# EAGLE design glitch_delay (EAGLE 8.6.0)
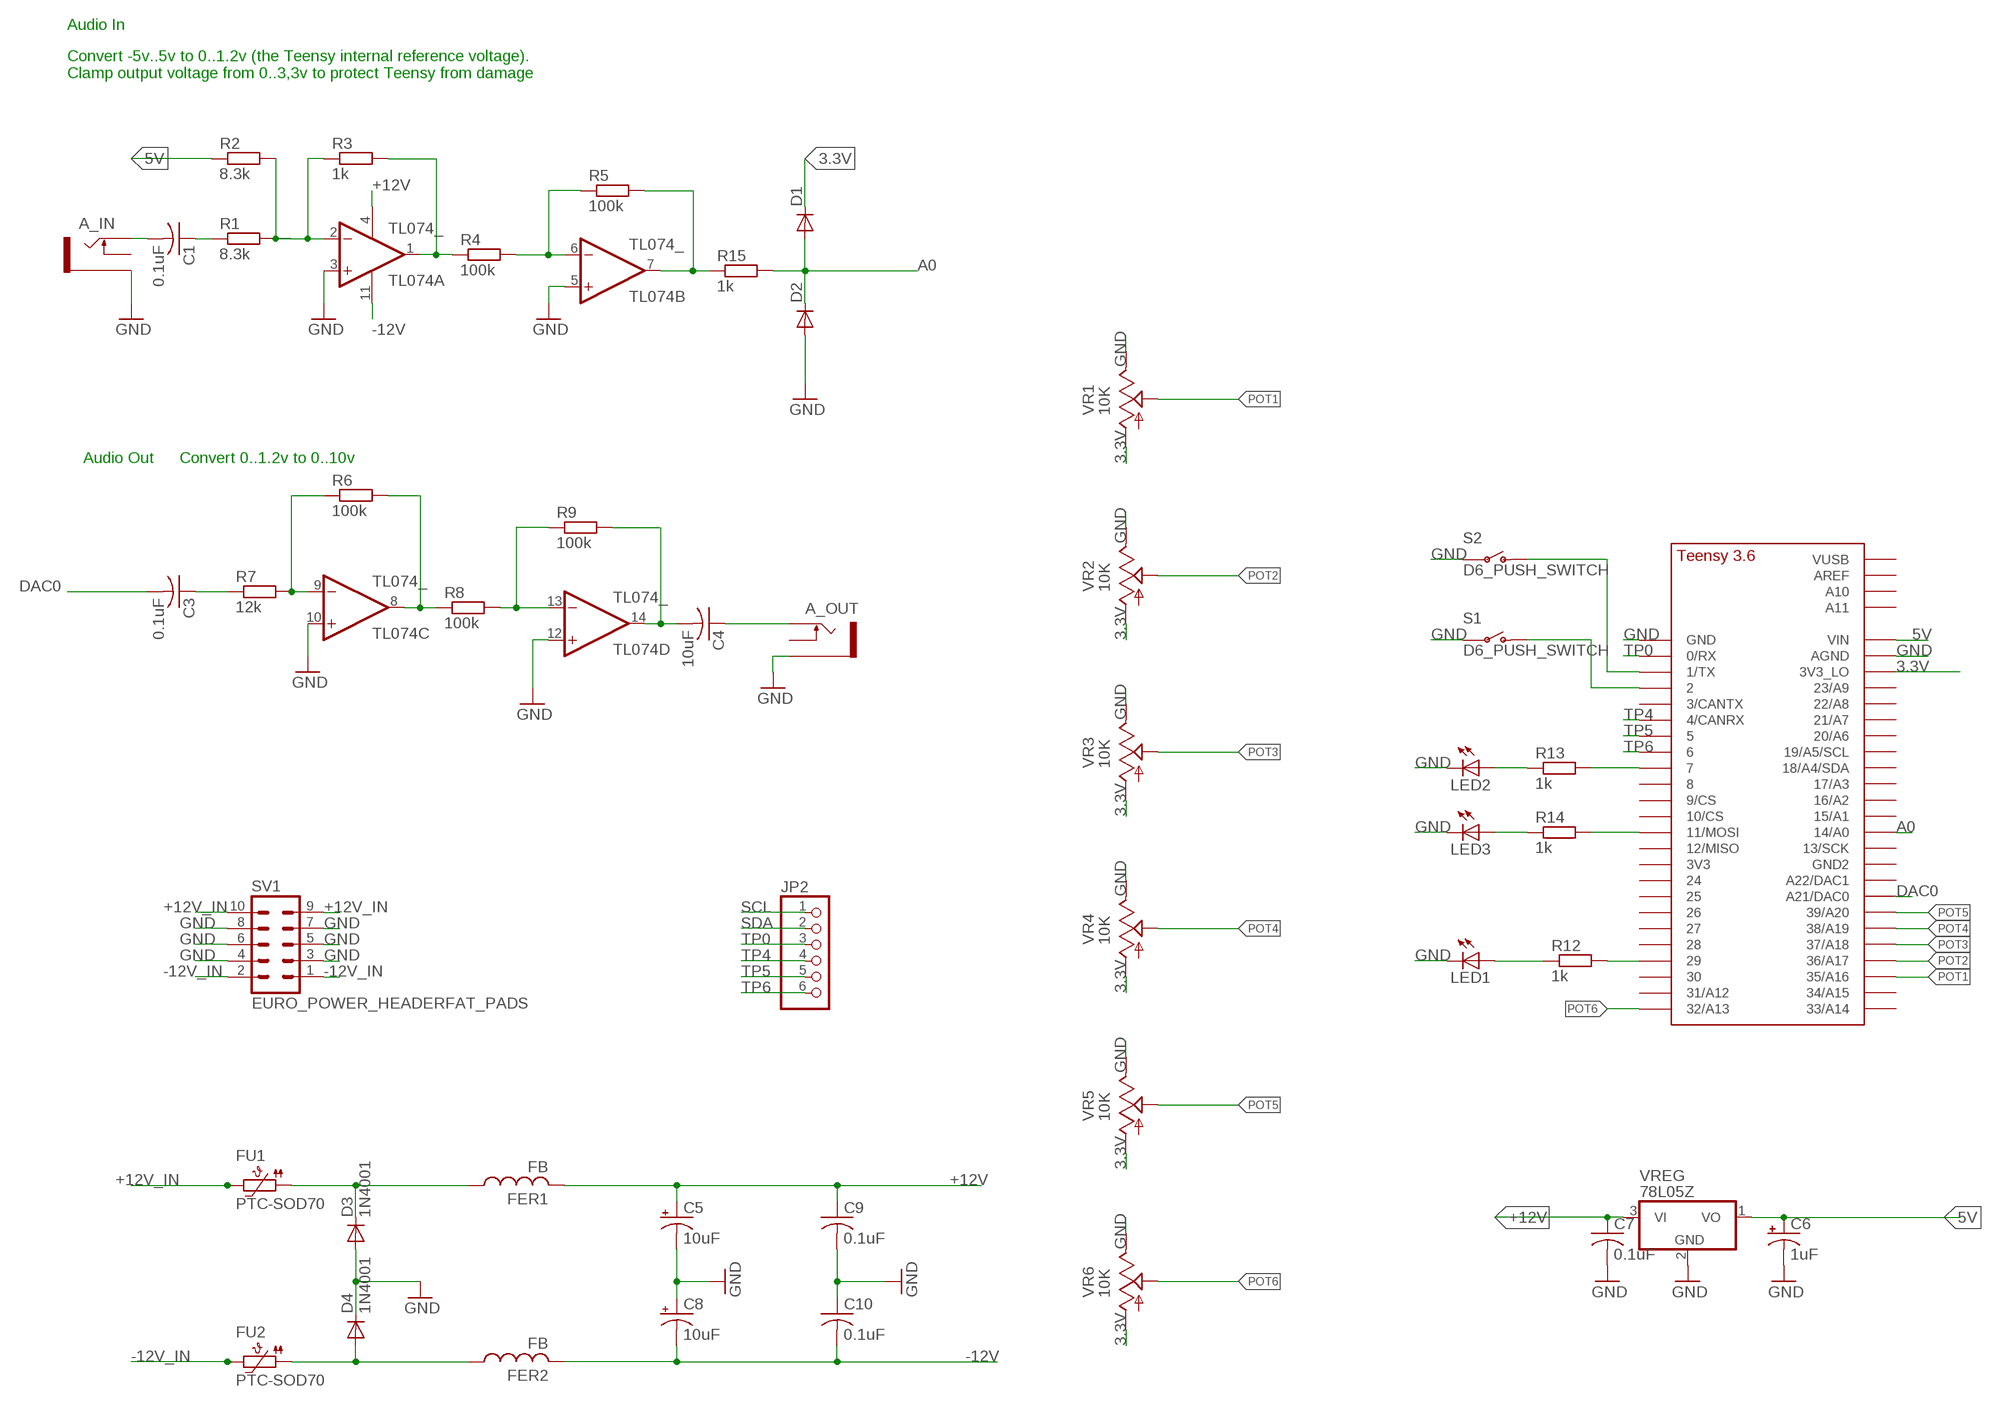
[diagram p0: schematic, sheet 1]

## Parts
A_IN  THONKICONNNEW  [WQP-PJ301M-12_JACK]
A_OUT  THONKICONNNEW  [WQP-PJ301M-12_JACK]
C1  0.1uF  C-US025-030X050  [C025-030X050]
C3  0.1uF  C-US025-030X050  [C025-030X050]
C4  10uF  C-US025-030X050  [C025-030X050]
C5  10uF  CPOL-USE2,5-6E  [E2,5-6E]
C6  1uF  CPOL-USE2.5-7  [E2,5-7]
C7  0.1uF  C-US025-030X050  [C025-030X050]
C8  10uF  CPOL-USE2,5-6E  [E2,5-6E]
C9  0.1uF  C-US025-030X050  [C025-030X050]
C10  0.1uF  C-US025-030X050  [C025-030X050]
D1  SMALL_DIODEDO35-7  [DO35-7]
D2  SMALL_DIODEDO35-7  [DO35-7]
D3  1N4001  1N4004  [DO41-10]
D4  1N4001  1N4004  [DO41-10]
FER1  FB  [FB]
FER2  FB  [FB]
FU1  PTC-SOD70  [SOD70]
FU2  PTC-SOD70  [SOD70]
JP2  PINHD-1X6  [1X06]
LED1  LED3MM  [LED3MM]
LED2  LED3MM  [LED3MM]
LED3  LED3MM  [LED3MM]
R1  8.3k  RESISTOR7MM  [7MM_RESISTOR]
R2  8.3k  RESISTOR7MM  [7MM_RESISTOR]
R3  1k  RESISTOR7MM  [7MM_RESISTOR]
R4  100k  RESISTOR7MM  [7MM_RESISTOR]
R5  100k  RESISTOR7MM  [7MM_RESISTOR]
R6  100k  RESISTOR7MM  [7MM_RESISTOR]
R7  12k  RESISTOR7MM  [7MM_RESISTOR]
R8  100k  RESISTOR7MM  [7MM_RESISTOR]
R9  100k  RESISTOR7MM  [7MM_RESISTOR]
R12  1k  RESISTOR7MM  [7MM_RESISTOR]
R13  1k  RESISTOR7MM  [7MM_RESISTOR]
R14  1k  RESISTOR7MM  [7MM_RESISTOR]
R15  1k  RESISTOR7MM  [7MM_RESISTOR]
S1  D6_PUSH_SWITCH  [D6_PUSH_SWITCH]
S2  D6_PUSH_SWITCH  [D6_PUSH_SWITCH]
SV1  EURO_POWER_HEADERFAT_PADS  [EURO_PWR_HEADER_FAT]
TL074  TL074_  [DIL14]
U$1  TEENSY_3.5/3.6_BASIC  [TEENSY_3.5/3.6_BASIC]
VR1  10K  9MM_SNAP-IN_POT_  [9MM_SNAP-IN_POT]
VR2  10K  9MM_SNAP-IN_POT_  [9MM_SNAP-IN_POT]
VR3  10K  9MM_SNAP-IN_POT_  [9MM_SNAP-IN_POT]
VR4  10K  9MM_SNAP-IN_POT_  [9MM_SNAP-IN_POT]
VR5  10K  9MM_SNAP-IN_POT_  [9MM_SNAP-IN_POT]
VR6  10K  9MM_SNAP-IN_POT_  [9MM_SNAP-IN_POT]
VREG  78L05Z  [TO92]

## Nets
3.3V: D1.C U$1.3V3_LO VR1.1(A) VR2.1(A) VR3.1(A) VR4.1(A) VR5.1(A) VR6.1(A)
5V: C6.+ R2.1 U$1.VIN VREG.1(VO)
+12V: C5.+ C7.1 C9.1 FER1.P$2 TL074.4(P:V+) VREG.3(VI)
+12V_IN: FU1.2 SV1.9 SV1.10
-12V: C8.- C10.2 FER2.P$2 TL074.11(P:V-)
-12V_IN: FU2.2 SV1.1 SV1.2
A0: D1.A D2.C R15.2 U$1.14/A0
DAC0: C3.2 U$1.21/DAC0(A21/DAC0)
GND: A_IN.P$3_SLEEVE(SLEEVE) A_OUT.P$3_SLEEVE(SLEEVE) C5.- C6.- C7.2 C8.+ C9.2 C10.1 D2.A D3.A D4.C LED1.K(C) LED2.K(C) LED3.K(C) S1.P$3(P) S1.P$4(P) S2.P$3(P) S2.P$4(P) SV1.3 SV1.4 SV1.5 SV1.6 SV1.7 SV1.8 TL074.3(A:+IN) TL074.5(B:+IN) TL074.10(C:+IN) TL074.12(D:+IN) U$1.AGND U$1.GND VR1.3(E) VR2.3(E) VR3.3(E) VR4.3(E) VR5.3(E) VR6.3(E) VREG.2(GND)
N$2: A_IN.P$1_TIP(TIP) C1.2
N$3: R1.2 R2.2 R3.1 TL074.2(A:-IN)
N$4: R3.2 R4.1 TL074.1(A:OUT)
N$6: R4.2 R5.1 TL074.6(B:-IN)
N$7: C1.1 R1.1
N$8: R5.2 R15.1 TL074.7(B:OUT)
N$9: LED1.A R12.1
N$13: C3.1 R7.1
N$14: R6.1 R7.2 TL074.9(C:-IN)
N$16: R6.2 R8.1 TL074.8(C:OUT)
N$17: R12.2 U$1.29
N$18: R8.2 R9.1 TL074.13(D:-IN)
N$19: LED2.A R13.1
N$20: S1.P$1(O) S1.P$2(O) U$1.2
N$21: C4.2 R9.2 TL074.14(D:OUT)
N$22: A_OUT.P$1_TIP(TIP) C4.1
N$23: LED3.A R14.1
N$25: S2.P$1(O) S2.P$2(O) U$1.1/TX
N$26: R13.2 U$1.7
N$27: R14.2 U$1.11/MOSI
N$29: D3.C FER1.P$1 FU1.1
N$30: D4.A FER2.P$1 FU2.1
POT1: U$1.35/A16 VR1.2(S)
POT2: U$1.36/A17 VR2.2(S)
POT3: U$1.37/A18 VR3.2(S)
POT4: U$1.38/A19 VR4.2(S)
POT5: U$1.39/A20 VR5.2(S)
POT6: U$1.32/A13 VR6.2(S)
SCL: JP2.1
SDA: JP2.2
TP0: JP2.3 U$1.0/RX
TP4: JP2.4 U$1.4/CANRX
TP5: JP2.5 U$1.5
TP6: JP2.6 U$1.6
Unconnected: A_IN.P$2_SWITCH(SWITCH) A_OUT.P$2_SWITCH(SWITCH) U$1.3/CANTX U$1.3V3 U$1.8 U$1.9/CS U$1.10/CS U$1.12/MISO U$1.13/SCK U$1.15/A1 U$1.16/A2 U$1.17/A3 U$1.18/A4/SDA U$1.19/A5/SCL U$1.20/A6 U$1.21/A7 U$1.22/A8 U$1.23/A9 U$1.24 U$1.25 U$1.26 U$1.27 U$1.28 U$1.30 U$1.31/A12 U$1.33/A14 U$1.34/A15 U$1.A10 U$1.A11 U$1.A22/DAC1 U$1.AREF U$1.GND2 U$1.VUSB

## Notes on the sheet
- Audio In
- Convert -5v..5v to 0..1.2v (the Teensy internal reference voltage).
  Clamp output voltage from 0..3,3v to protect Teensy from damage
- Audio Out | Convert 0..1.2v to 0..10v

## Library data of the parts
A_IN A_OUT = MusicThingModular:THONKICONN: 3.5mm socket for Eurorack modular synths
C1 C3 C4 C7 C9 C10 = adafruit:C-US: CAPACITOR, American symbol
C5 C6 C8 = adafruit:CPOL-US: POLARIZED CAPACITOR, American symbol
D1 D2 = MusicThingModular:SMALL_DIODE: Small Signal Diode
D3 D4 = adafruit:1N4004: DIODE General purpose 1N400x type rectifier (With bigger pads) http://www.ladyada.net/library/pcb/eaglelibrary.html
FER1 FER2 = adafruit:FB: Ferrite bead Digikey #P9821BK-ND
FU1 FU2 = ptc-ntc:PTC-: Positive Temperature Coefficient Resistor (PTC) termistor Philips KTY81-210 - KTY81-252 Source: 153627-da-01-en-Temperatur-Sensor_KTY10-6_Philips.pdf; OC_FARNELL: unknown; OC_NEWARK: unknown
JP2 = adafruit:PINHD-1X6: PIN HEADER
LED1-LED3 = adafruit:LED: LED OSRAM: - CHIPLED LG R971, LG N971, LY N971, LG Q971, LY Q971, LO R971, LY R971 LH N974, LH R974 LS Q976, LO Q976, LY Q976 LO Q996 - Hyper CHIPLED LW Q18S LB Q993, LB Q99A, LB R99A - SideLED LS A670, LO A670, LY A670, LG A670, LP A670 LB A673, LV A673, LT A673, LW A673 LH A674 LY A675 LS A676, LA A676, LO A676, LY A676, LW A676 LS A679, LY A679, LG A679 - Hyper Micro SIDELED® LS Y876, LA Y876, LO Y876, LY Y876 LT Y87S - SmartLED LW L88C, LW L88S LB L89C, LB L89S, LG L890 LS L89K, LO L89K, LY L89K LS L896, LA L896, LO L896, LY L896 - TOPLED LS T670, LO T670, LY T670, LG T670, LP T670 LSG T670, LSP T670, LSY T670, LOP T670, LYG T670 LG T671, LOG T671, LSG T671 LB T673, LV T673, LT T673, LW T673 LH T674 LS T676, LA T676, LO T676, LY T676, LB T676, LH T676, LSB T676, LW T676 LB T67C, LV T67C, LT T67C, LS T67K, LO T67K, LY T67K, LW E67C LS E67B, LA E67B, LO E67B, LY E67B, LB E67C, LV E67C, LT E67C LW T67C LS T679, LY T679, LG T679 LS T770, LO T770, LY T770, LG T770, LP T770 LB T773, LV T773, LT T773, LW T773 LH T774 LS E675, LA E675, LY E675, LS T675 LS T776, LA T776, LO T776, LY T776, LB T776 LHGB T686 LT T68C, LB T68C - Hyper Mini TOPLED® LB M676 - Mini TOPLED Santana® LG M470 LS M47K, LO M47K, LY M47K Source: http://www.osram.convergy.de/
R1-R9 R12-R15 = MusicThingModular:RESISTOR: Standard resistor, various versions
S1 S2 = MusicThingModular:D6_PUSH_SWITCH: Push switch
SV1 = MusicThingModular:EURO_POWER_HEADER: Power Header 10 pin power header for Eurorack Power Supplies Variants with fatter pads for easier soldering, and the LOCK variant which has 5mil offset pins to hold the component in place before soldering
TL074 = MusicThingModular:TL074: Generic Quad Op Amp
U$1 = Teensy356:TEENSY_3.5/3.6_BASIC
VR1-VR6 = MusicThingModular:9MM_SNAP-IN_POT: 9mm vertical snap-in pot, Alpha / Panasonic style
VREG = adafruit:78*: Positive VOLTAGE REGULATOR Added bigger pads to the TO-92 package

## Board
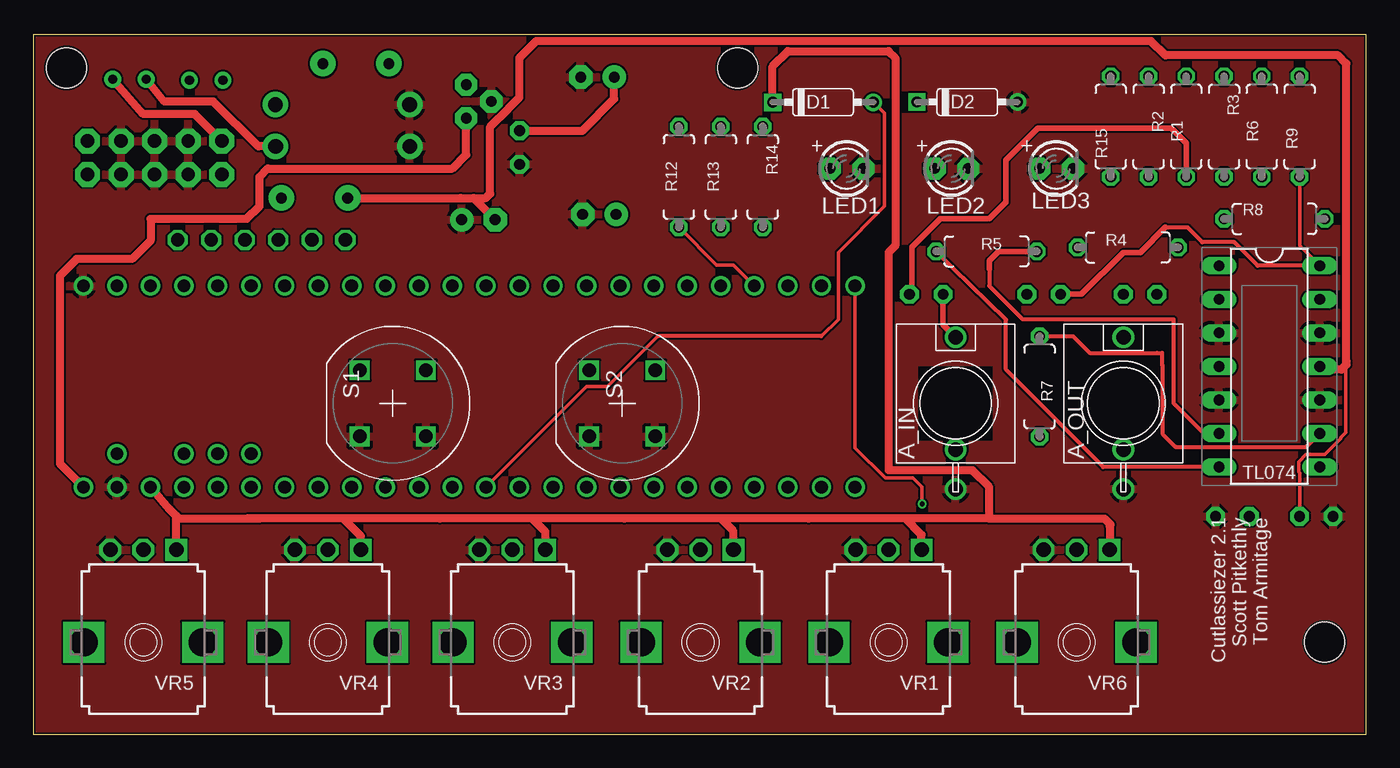
[diagram p1: board, top side]
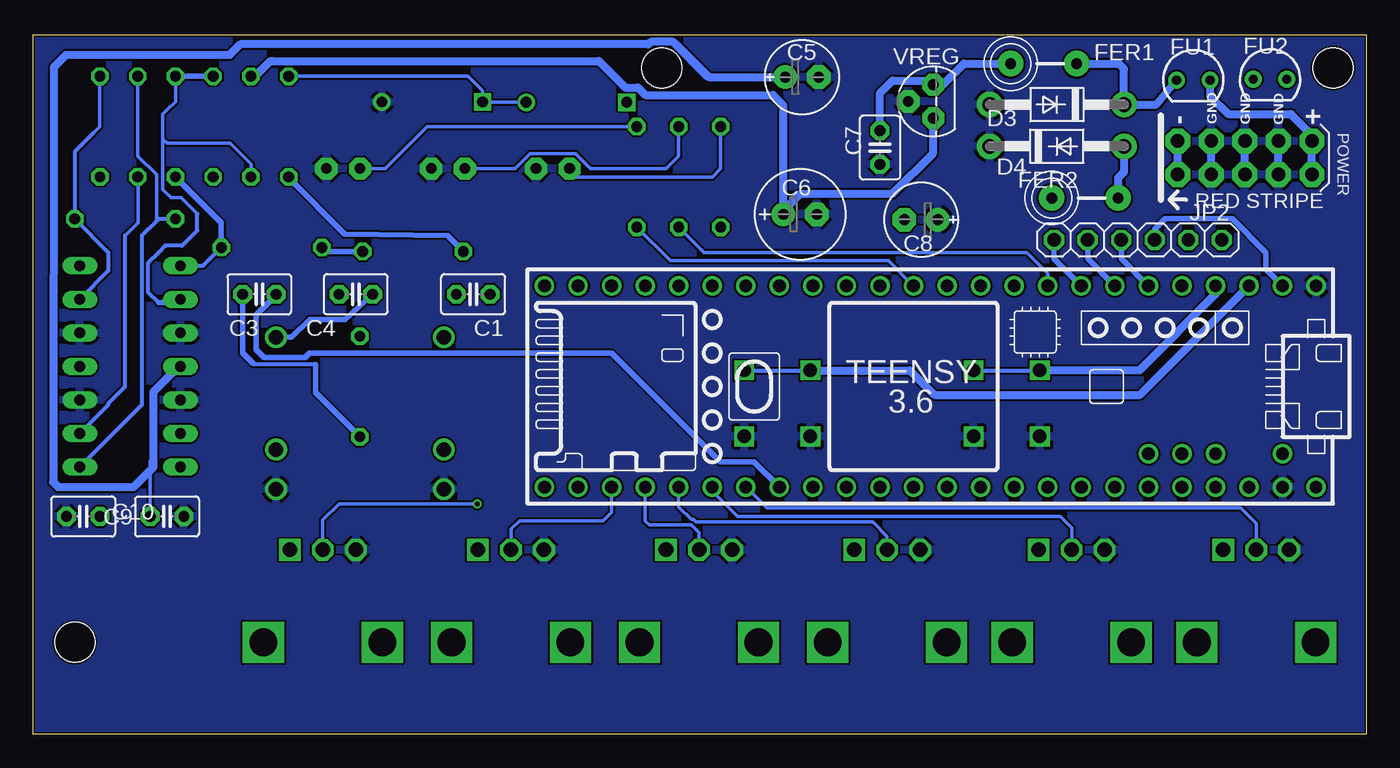
[diagram p2: board, bottom side, seen from below]

Size 100.95 x 53.01 mm. Coordinates in mm from the lower left corner, seen from the top.
Outline: 0,0 100.95,0 100.95,53.01 0,53.01 0,0
Copper layers (1*16): Top 0.035mm / dielectric 1.5mm / Bottom 0.035mm
Design rules "hackvana": minimum track width 6mil, minimum drill 0.3mm, track to track 6mil, track to pad 6mil, pad to pad 6mil, via to via 6mil, smd to smd 0mil, copper to edge 6mil, drill to drill 6mil, minimum pad ring 10mil, minimum via ring 6mil, stop-mask expansion 2mil, vias tented up to drill 100mil, thermal gap 10mil
Holes 3.05 mm at 2.54,50.48 97.79,6.98 53.34,50.48

### Footprints (pad centres in the part's own frame; a part is rotated, then mirrored left to right if it is on the bottom)
WQP-PJ301M-12_JACK = drill 1.1: P$1_TIP 0,5; P$2_SWITCH 0,-3.5; P$3_SLEEVE 0,-6.5
C025-030X050 = drill 0.813 pad 1.422 octagon: 1 -1.27,0; 2 1.27,0
E2,5-6E = drill 0.813 pad 1.778: + -1.27,0 | drill 0.813 pad 1.778 octagon: - 1.27,0
E2,5-7 = drill 0.813 pad 1.778: + -1.27,0 | drill 0.813 pad 1.778 octagon: - 1.27,0
DO35-7 = drill 0.813: A 3.81,0 | drill 0.813 square: C -3.81,0
DO41-10 = drill 1.118 pad 1.93: A 5.08,0; C -5.08,0
FB = drill 0.8 pad 1.93: P$1 -2.5,0; P$2 2.5,0
SOD70 = drill 0.7 pad 1.27: 1 -1.27,0; 2 1.27,0
1X06 = drill 1.016 octagon: 1 -6.35,0; 2 -3.81,0; 3 -1.27,0; 4 1.27,0; 5 3.81,0; 6 6.35,0
LED3MM = drill 0.813 pad 1.676 octagon: A -1.27,0; K 1.27,0
7MM_RESISTOR = drill 0.813 octagon: 1 -3.81,0; 2 3.81,0
D6_PUSH_SWITCH = drill 1 square: P$1 -2.5,2.5; P$2 2.5,2.5; P$3 2.5,-2.5; P$4 -2.5,-2.5
EURO_PWR_HEADER_FAT = drill 1.016 pad 1.88 octagon: 1 -5.08,-1.27; 2 -5.08,1.27; 3 -2.54,-1.27; 4 -2.54,1.27; 5 0,-1.27; 6 0,1.27; 7 2.54,-1.27; 8 2.54,1.27; 9 5.08,-1.27; 10 5.08,1.27
DIL14 = drill 0.813 long: 1 -7.62,-3.81; 2 -5.08,-3.81; 3 -2.54,-3.81; 4 0,-3.81; 5 2.54,-3.81; 6 5.08,-3.81; 7 7.62,-3.81; 8 7.62,3.81; 9 5.08,3.81; 10 2.54,3.81; 11 0,3.81; 12 -2.54,3.81; 13 -5.08,3.81; 14 -7.62,3.81
TEENSY_3.5/3.6_BASIC = drill 0.965: 0/RX -25.4,-7.62; 1/TX -22.86,-7.62; 2 -20.32,-7.62; 3/CANTX -17.78,-7.62; 3V3 7.62,-7.62; 3V3_LO -22.86,7.62; 4/CANRX -15.24,-7.62; 5 -12.7,-7.62; 6 -10.16,-7.62; 7 -7.62,-7.62; 8 -5.08,-7.62; 9/CS -2.54,-7.62; 10/CS 0,-7.62; 11/MOSI 2.54,-7.62; 12/MISO 5.08,-7.62; 13/SCK 5.08,7.62; 14/A0 2.54,7.62; 15/A1 0,7.62; 16/A2 -2.54,7.62; 17/A3 -5.08,7.62; 18/A4/SDA -7.62,7.62; 19/A5/SCL -10.16,7.62; 20/A6 -12.7,7.62; 21/A7 -15.24,7.62; 21/DAC0 12.7,7.62; 22/A8 -17.78,7.62; 23/A9 -20.32,7.62; 24 10.16,-7.62; 25 12.7,-7.62; 26 15.24,-7.62; 27 17.78,-7.62; 28 20.32,-7.62; 29 22.86,-7.62; 30 25.4,-7.62; 31/A12 27.94,-7.62; 32/A13 30.48,-7.62; 33/A14 30.48,7.62; 34/A15 27.94,7.62; 35/A16 25.4,7.62; 36/A17 22.86,7.62; 37/A18 20.32,7.62; 38/A19 17.78,7.62; 39/A20 15.24,7.62; A10 -17.78,5.08; A11 -15.24,5.08; A22/DAC1 10.16,7.62; AGND -25.4,7.62; AREF -20.32,5.08; GND -27.94,-7.62; GND2 7.62,7.62; VIN -27.94,7.62; VUSB -25.4,5.08
9MM_SNAP-IN_POT = drill 1.1 square: 1 -2.5,-7 | drill 1.1 octagon: 2 0,-7; 3 2.5,-7 | drill 2.1 square: CHASSIS1 -4.5,0; CHASSIS2 4.5,0
TO92 = drill 0.813 pad 1.676 octagon: 1 -1.27,0; 2 0,1.905; 3 1.27,0

### Placement (x,y rotation side)
A_IN  69.85,25.08 0 top
A_OUT  82.55,25.08 0 top
C1  67.63,33.34 180 bottom
C3  83.82,33.34 0 bottom
C4  76.52,33.34 180 bottom
C5  42.74,49.78 0 bottom
C6  42.87,39.4 0 bottom
C7  36.83,44.45 270 bottom
C8  33.72,38.99 180 bottom
C9  90.81,16.51 0 bottom
C10  97.16,16.51 0 bottom
D1  59.81,47.88 0 top
D2  70.73,47.9 0 top
D3  23.43,47.7 180 bottom
D4  23.45,44.54 0 bottom
FER1  24.45,50.8 180 bottom
FER2  21.32,40.62 180 bottom
FU1  13.11,49.56 0 bottom
FU2  7.3,49.62 0 bottom
JP2  17.3,37.45 180 bottom
LED1  61.59,42.86 0 top
LED2  69.53,42.86 0 top
LED3  77.47,42.86 0 top
R1  87.31,46.04 90 top
R2  84.45,46.04 270 top
R3  90.17,46.04 270 top
R4  82.89,36.88 180 top
R5  72.18,36.58 180 top
R6  93.03,46.04 90 top
R7  76.2,26.35 90 top
R8  93.98,39.05 0 top
R9  95.89,46.04 270 top
R12  48.9,42.23 270 top
R13  52.07,42.23 270 top
R14  55.24,42.23 270 top
R15  81.6,46.04 90 top
S1  27.24,25.08 0 top
S2  44.61,25.08 0 top
SV1  9.21,43.67 0 bottom
TL074  93.6,27.88 270 top
U$1  31.75,26.35 180 bottom
VR1  64.77,6.98 180 top
VR2  50.53,6.98 180 top
VR3  36.29,6.98 180 top
VR4  22.32,6.98 180 top
VR5  8.35,6.98 180 top
VR6  79.01,6.98 180 top
VREG  32.8,47.94 90 bottom

### Tracks (layer width: path | path; a pad name or v marks a point on that pad's centre or on a via)
3.3V
  Top 0.61: U$1.3V3_LO 10.37,17.05 10.85,16.56 | 23.5,16.36 30.8,16.36 37.78,16.36 | 23.5,16.36 17.14,16.36 | 17.14,16.36 16.19,16.36 | 37.78,16.36 44.77,16.36 52.07,16.36 | 52.07,16.36 58.74,16.36 66.04,16.36 | 72.39,16.36 66.04,16.36 | 72.39,16.36 72.39,18.73 71.12,20 64.77,20 64.77,36.51 65.28,37.02 65.28,51.24 64.77,51.75 57.15,51.75 56,50.6 D1.C | VR5.1 10.85,16.56 | 10.85,16.56 11.05,16.36 17.14,16.36 | VR4.1 24.82,15.04 23.5,16.36 | VR3.1 38.79,15.35 37.78,16.36 | VR2.1 53.03,15.4 52.07,16.36 | VR1.1 67.27,15.13 66.04,16.36 | 72.39,16.36 81.11,16.36 81.6,15.87 81.51,15.79 VR6.1
5V
  Top 0.61: U$1.VIN 2.03,20.51 2.03,34.73 3.3,36 7.49,36 8.89,37.4 8.89,39.05 16.19,39.05 17.14,40 17.14,42.23 17.78,42.86 31.75,42.86 32.8,43.91 VREG.1
  Bottom 0.61: R2.1 84.14,49.85 83,50.98 82.86,50.99 58.1,50.99 56.11,49 55.15,49 54.57,48.42 44.93,48.42 44.14,47.64 C6.+ 44.14,39.68 42.86,40.96 35.88,40.96 32.8,44.04 VREG.1
+12V
  Top 0.61: C7.1 41.59,45.72 44.01,48.13 C5.+
  Bottom 0.254: C9.1 92.08,20.7 91.82,20.96
  Bottom 0.61: TL074.4 90.04,27.62 90.17,27.62 91.82,25.97 91.82,20.96 91.82,20.26 93.34,18.73 99.06,18.73 99.44,19.11 99.38,50.55 98.46,51.47 86.05,51.47 85.26,52.26 54.37,52.26 54.16,52.46 52.52,52.46 49.84,49.78 49.78,49.78 | 51.91,51.91 52.26,52.26 51.91,51.91 | 51.91,51.91 51.28,51.28 | 51.28,51.28 51.12,51.12 | 51.28,51.28 49.78,49.78 | 49.78,49.78 C5.+ | C7.1 36.83,48.58 35.88,49.53 33.11,49.53 VREG.3 32.07,49.21 30.48,50.8 FER1.P$2
+12V_IN
  Bottom 0.61: SV1.9 SV1.10 4.13,45.4 5.71,46.99 10.48,46.99 11.84,48.36 FU1.2
-12V
  Top 0.254: C10.2 95.89,19.79 95.81,19.87 95.81,20.65 96.36,21.2 97.8,21.2 99.01,22.41 99.01,22.49 99.38,22.86 99.38,28.19 99.44,28.26
  Top 0.61: TL074.11 97.66,27.62 99.06,27.62 99.44,28 99.44,28.26 99.44,50.8 98.81,51.43 85.72,51.43 84.64,52.51 46.16,52.51 38.1,52.51 36.83,51.24 36.83,48.26 36,47.43 36,47.41 34.61,46.02 34.61,40.96 34.27,40.62 32.38,40.62 | FER2.P$2 32.38,40.62 | 32.38,40.62 33.35,40.62 C8.-
-12V_IN
  Top 0.61: SV1.2 12.24,46.99 8.35,46.99 FU2.2
  Bottom 0.61: SV1.1 SV1.2
A0
  Top 0.254: 59.69,30.16 60.96,31.43 60.96,36.51 64.45,40 64.45,47.05 D1.A | U$1.14/A0 41.91,26.35 43.5,26.35 47.31,30.16
  Top 0.305: 59.69,30.16 47.31,30.16
  Bottom 0.254: R15.2 68.02,49.85 66.92,48.75 D2.C 63.64,47.9 D1.A
DAC0
  Bottom 0.406: C3.2 82.55,33.27 84.07,31.75 84.07,29.15 83.46,28.53 80.37,28.53 80.01,28.89 57.15,28.89 55.56,27.31 48.9,20.64 46.35,20.64 U$1.21/DAC0
GND
  Bottom 0.61: SV1.7 SV1.8 | SV1.5 SV1.6 | SV1.3 SV1.4
  pour Top: -1.27,56.83 -1.27,-7.94 102.87,-7.94 102.87,56.83
  pour Bottom: -2.86,55.88 -2.54,-9.21 104.14,-9.21 103.82,55.88
N$2
  Top 0.406: C1.2 68.9,33.02 68.9,31.03 A_IN.P$1_TIP
N$3
  Bottom 0.254: 90.93,47.18 90.81,47.31 | 90.81,47.31 90.17,47.94 R3.1 | 88.52,39.43 89.72,40.64 90.49,40.64 91.12,41.28 91.12,45.08 | 91.12,45.08 91.12,46.99 90.81,47.31 | R2.2 84.45,43.18 86.04,44.77 90.81,44.77 91.12,45.08
  Bottom 0.305: 88.52,39.43 88.52,38.16 88.9,37.78 89.66,37.02 90.93,37.02 91.44,36.51 92.25,35.7 92.25,34.43 92.25,33.52 91.44,32.7
  Bottom 0.406: 91.44,32.7 90.04,32.7 TL074.2 | R1.2 R3.1
N$4
  Bottom 0.305: TL074.1 88.08,35.5 R4.1
  Bottom 0.406: R4.1 86.69,38.75 R3.2
N$6
  Top 0.305: TL074.6 88.65,22.8 86.36,25.08 86.36,31.43 84.14,31.43 83.82,31.43 74.93,31.43 72.39,33.97 72.39,35.24
  Top 0.406: R5.1 73.09,36.58 72.39,35.88 72.39,35.24
  Bottom 0.406: R5.1 78.77,36.58 R4.2
N$7
  Top 0.406: C1.1 66.55,33.12 66.55,36.89 68.71,39.05 72.39,39.05 73.66,40.32 73.66,43.5 76.07,45.91 86.17,45.91 87.31,44.77 R1.1
N$8
  Top 0.305: TL074.7 81.03,20.26 73.66,27.62 73.66,31.42 R5.2
  Bottom 0.406: R5.2 69.58,37.78 77.34,37.91 81.6,42.16 R15.1
N$9
  Bottom 0.254: LED1.A 60.01,42.23 49.53,42.23 48.9,42.86 R12.1
N$13
  Bottom 0.305: 79.61,28.03 84.22,28.03 84.28,28.09
  Bottom 0.406: 79.61,28.03 79.55,27.97 79.55,25.89 R7.1 | 84.28,28.09 85.09,28.89 C3.1
N$14
  Top 0.305: R7.2 78.74,30.16 80.01,28.89 85.09,28.89 85.47,28.89 85.47,27.98 85.5,27.95 85.5,22.77 86.49,21.78 96.39,21.78 TL074.9
  Bottom 0.254: 93.98,37.78 93,38.76 93,41.94
  Bottom 0.305: 93,41.94 R6.1 | TL074.9 95.25,24.96 95.25,25.08 93.98,26.35 93.98,37.78
N$16
  Bottom 0.254: 91.6,38.89 91.6,42.39 93.03,43.82 R6.2
  Bottom 0.305: R8.1 91.44,39.05 91.6,38.89 92.71,37.78 92.71,24.96 TL074.8
  Bottom 0.406: TL074.8 96.27,20.26
N$17
  Top 0.254: R12.2 51.75,35.56 53.02,35.56 U$1.29
N$18
  Bottom 0.254: R9.1 95.89,46.04 96.38,45.54
  Bottom 0.305: 96.38,45.54 97.79,44.13 R8.2 95.25,36.51 95.25,35.12 TL074.13
N$19
  Bottom 0.254: R13.1 52.07,43.82 53.02,42.86 58.74,42.86 59.86,43.98 63.33,43.98 64.45,42.86 LED2.A
N$20
  Bottom 0.305: S1.P$2 S1.P$1
  Bottom 0.61: U$1.2 11.43,33.34 17.18,27.58 S1.P$1
N$21
  Top 0.254: TL074.14 95.89,37.02 R9.2
  Top 0.305: TL074.14 92.71,35.5 90.93,37.27 88.52,37.27 87.38,38.42 85.72,38.42
  Top 0.406: 85.72,38.42 83.82,36.51 82.55,36.51 79.38,33.34 C4.2
N$22
  Bottom 0.406: A_OUT.P$1_TIP 81.36,30.08 80.01,31.43 77.33,31.43 C4.1
N$23
  Bottom 0.254: LED3.A 74.3,42.86 71.12,46.04 R14.1
N$25
  Bottom 0.305: S2.P$2 S2.P$1
  Bottom 0.61: S2.P$1 34.57,27.58 32.7,25.72 17.14,25.72 U$1.1/TX
N$26
  Bottom 0.254: U$1.7 24.13,34.93 25.72,36.51 50.16,36.51 R13.2
N$27
  Bottom 0.254: U$1.11/MOSI 36.2,35.88 52.7,35.88 R14.2
N$29
  Bottom 0.61: FU1.1 15.92,47.7 D3.C 18.35,50.42 18.73,50.8 FER1.P$1
N$30
  Top 0.61: D4.A 17.05,44.54 13.65,47.94 9.94,47.94 FU2.1
  Bottom 0.61: D4.A 18.37,42.59 18.82,42.14 FER2.P$1
POT1
  Bottom 0.254: U$1.35/A16 57.15,16.83 57.78,16.19 64.14,16.19 64.77,15.56 VR1.2
POT2
  Bottom 0.254: U$1.36/A17 54.61,16.19 54.29,15.87 51.12,15.87 50.53,15.29 VR2.2
POT3
  Bottom 0.254: VR3.2 36.29,15.02 37.38,16.1 50.77,16.1 50.95,16.28 51.12,16.28 52.07,17.23 U$1.37/A18
POT4
  Bottom 0.254: 22.32,13.34 VR4.2 22.32,15.65 23.18,16.51 44.13,16.51 | U$1.38/A19 49.53,18.42 47.62,16.51 44.13,16.51 | 44.13,16.51 45.72,16.51
POT5
  Bottom 0.254: U$1.39/A20 45.4,17.14 9.53,17.14 8.35,15.97 VR5.2
POT6  (via drill 0.35)
  Top 0.254: U$1.32/A13 62.23,21.72 64.53,19.42 66.62,19.42 67.31,18.73 v67.31,17.46
  Bottom 0.254: VR6.2 79.01,16.24 77.79,17.46 v67.31,17.46
TP0
  Bottom 0.406: JP2.3 16.03,38.26 15.24,39.05 10.16,39.05 7.62,36.51 7.62,35.24 U$1.0/RX
TP4
  Bottom 0.406: JP2.4 18.57,36.03 U$1.4/CANRX
TP5
  Bottom 0.406: JP2.5 21.11,36.03 U$1.5
TP6
  Bottom 0.406: JP2.6 23.65,36.03 U$1.6

### Text on the board
tNames: Cutlassiezer 2.1 / Scott Pitkethly / Tom Armitage